# Altium schematic sheet Main.SchDoc
size A4
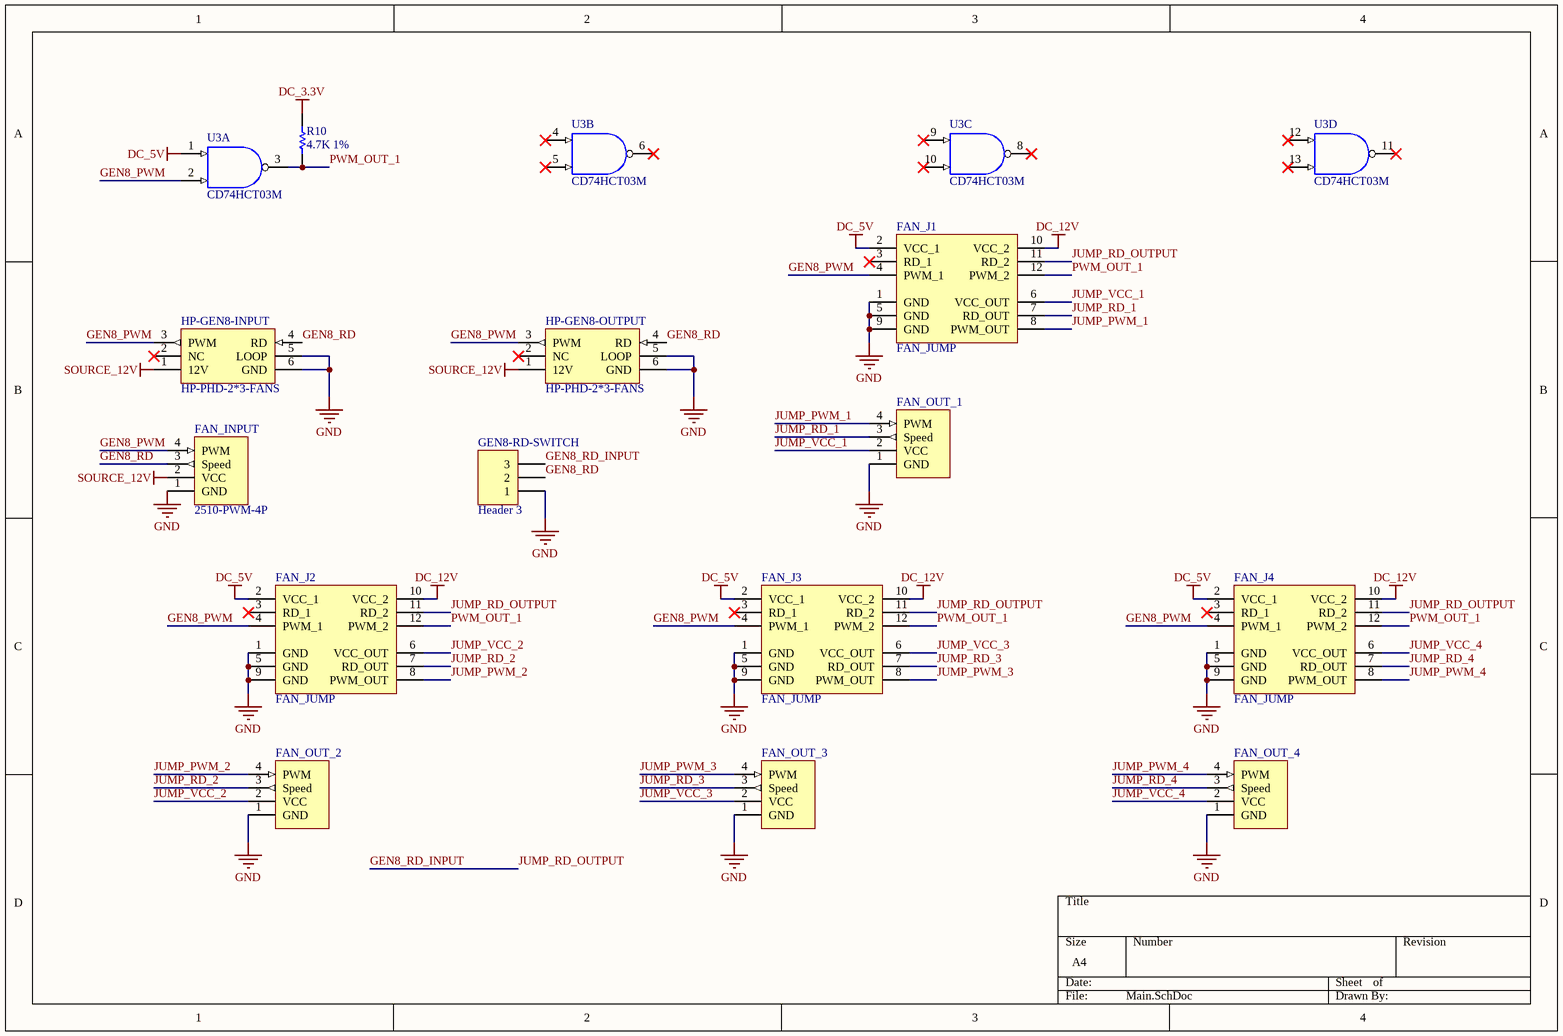
[diagram p0: Main.SchDoc]

## Parts
FAN_INPUT  2510-PWM-4P  [2510-PWM-4PIN]
FAN_J1  FAN_JUMP  [FAN_JUMP]
FAN_J2  FAN_JUMP  [FAN_JUMP]
FAN_J3  FAN_JUMP  [FAN_JUMP]
FAN_J4  FAN_JUMP  [FAN_JUMP]
FAN_OUT_1  (no value)  [2510-PWM-4PIN]
FAN_OUT_2  (no value)  [2510-PWM-4PIN]
FAN_OUT_3  (no value)  [2510-PWM-4PIN]
FAN_OUT_4  (no value)  [2510-PWM-4PIN]
GEN8-RD-SWITCH  Header 3  [HDR1X3]
HP-GEN8-INPUT  HP-PHD-2*3-FANS  [PHD-2*3AW]
HP-GEN8-OUTPUT  HP-PHD-2*3-FANS  [PHD-2*3AW]
R10  4.7K 1%  [RESC0805(2012)_L]
U3  CD74HCT03M  [D0014A_L]  (parts A,B,C,D of 5)

## Nets
DC_3.3V: R10.2
DC_5V: FAN_J1.2(VCC_1) FAN_J2.2(VCC_1) FAN_J3.2(VCC_1) FAN_J4.2(VCC_1) U3.1(1A)
DC_12V: FAN_J1.10(VCC_2) FAN_J2.10(VCC_2) FAN_J3.10(VCC_2) FAN_J4.10(VCC_2)
GND: FAN_INPUT.1(GND) FAN_J1.1(GND) FAN_J1.5(GND) FAN_J1.9(GND) FAN_J2.1(GND) FAN_J2.5(GND) FAN_J2.9(GND) FAN_J3.1(GND) FAN_J3.5(GND) FAN_J3.9(GND) FAN_J4.1(GND) FAN_J4.5(GND) FAN_J4.9(GND) FAN_OUT_1.1(GND) FAN_OUT_2.1(GND) FAN_OUT_3.1(GND) FAN_OUT_4.1(GND) GEN8-RD-SWITCH.1 HP-GEN8-INPUT.5(LOOP) HP-GEN8-INPUT.6(GND) HP-GEN8-OUTPUT.5(LOOP) HP-GEN8-OUTPUT.6(GND)
SOURCE_12V: FAN_INPUT.2(VCC) HP-GEN8-INPUT.1(12V) HP-GEN8-OUTPUT.1(12V)
GEN8_PWM: FAN_INPUT.4(PWM) FAN_J1.4(PWM_1) FAN_J2.4(PWM_1) FAN_J3.4(PWM_1) FAN_J4.4(PWM_1) HP-GEN8-INPUT.3(PWM) HP-GEN8-OUTPUT.3(PWM) U3.2(1B)
GEN8_RD: FAN_INPUT.3(Speed) GEN8-RD-SWITCH.2 HP-GEN8-INPUT.4(RD) HP-GEN8-OUTPUT.4(RD)
GEN8_RD_INPUT: FAN_J1.11(RD_2) FAN_J2.11(RD_2) FAN_J3.11(RD_2) FAN_J4.11(RD_2) GEN8-RD-SWITCH.3  [also labelled JUMP_RD_OUTPUT]
JUMP_PWM_1: FAN_J1.8(PWM_OUT) FAN_OUT_1.4(PWM)
JUMP_PWM_2: FAN_J2.8(PWM_OUT) FAN_OUT_2.4(PWM)
JUMP_PWM_3: FAN_J3.8(PWM_OUT) FAN_OUT_3.4(PWM)
JUMP_PWM_4: FAN_J4.8(PWM_OUT) FAN_OUT_4.4(PWM)
JUMP_RD_1: FAN_J1.7(RD_OUT) FAN_OUT_1.3(Speed)
JUMP_RD_2: FAN_J2.7(RD_OUT) FAN_OUT_2.3(Speed)
JUMP_RD_3: FAN_J3.7(RD_OUT) FAN_OUT_3.3(Speed)
JUMP_RD_4: FAN_J4.7(RD_OUT) FAN_OUT_4.3(Speed)
JUMP_VCC_1: FAN_J1.6(VCC_OUT) FAN_OUT_1.2(VCC)
JUMP_VCC_2: FAN_J2.6(VCC_OUT) FAN_OUT_2.2(VCC)
JUMP_VCC_3: FAN_J3.6(VCC_OUT) FAN_OUT_3.2(VCC)
JUMP_VCC_4: FAN_J4.6(VCC_OUT) FAN_OUT_4.2(VCC)
PWM_OUT_1: FAN_J1.12(PWM_2) FAN_J2.12(PWM_2) FAN_J3.12(PWM_2) FAN_J4.12(PWM_2) R10.1 U3.3(1Y)

Not connected (* = marked no-connect by the designer): FAN_J1 3(RD_1)*; FAN_J2 3(RD_1)*; FAN_J3 3(RD_1)*; FAN_J4 3(RD_1)*; HP-GEN8-INPUT 2(NC)*; HP-GEN8-OUTPUT 2(NC)*; U3 4(2A)* 5(2B)* 6(2Y)* 8(3Y)* 9(3A)* 10(3B)* 11(4Y)* 12(4A)* 13(4B)*

## Library data of the parts
FAN_OUT_1-FAN_OUT_4 = 2510-PWM-4P
GEN8-RD-SWITCH = Header 3: Header, 3-Pin; LatestRevisionDate: 17-Jul-2002; LatestRevisionNote: Re-released for DXP Platform.; Publisher: Altium Limited
R10 = CMP-1013-00736-1: Value: 100000.00 Ohm; Case-Metric: 2012; Power: 0.125 W; Case-EIA: 0805; Tolerance: 1 %; Technology: SMT
U3 = CMP-1627-00022-2: High Speed CMOS Logic Quad 2-Input NAND Gates with Open Drain, D0014A, TUBE; Manufacturer: Texas Instruments; Bits(#): 4; F @ Nom Voltage(Max)(Mhz): 25; Schmitt Trigger: No; Input Type: TTL; ICC @ Nom Voltage(Max)(mA): 0.02; Technology Family: HCT; VCC(Max)(V): 5.5; VCC(Min)(V): 4.5; tpd @ Nom Voltage(Max)(ns): 30; Output Drive (IOL/IOH)(Max)(mA): 0/4; Rating: Catalog; Voltage(Nom)(V): 5; Code_JEDEC: MS-012; Output Type: CMOS; Generic Part Number: CD74HCT03; PackageReference: D0014A; Operating Temperature Range(C): -55 to 125; DatasheetVersion: SCHS126D; PartId: 1